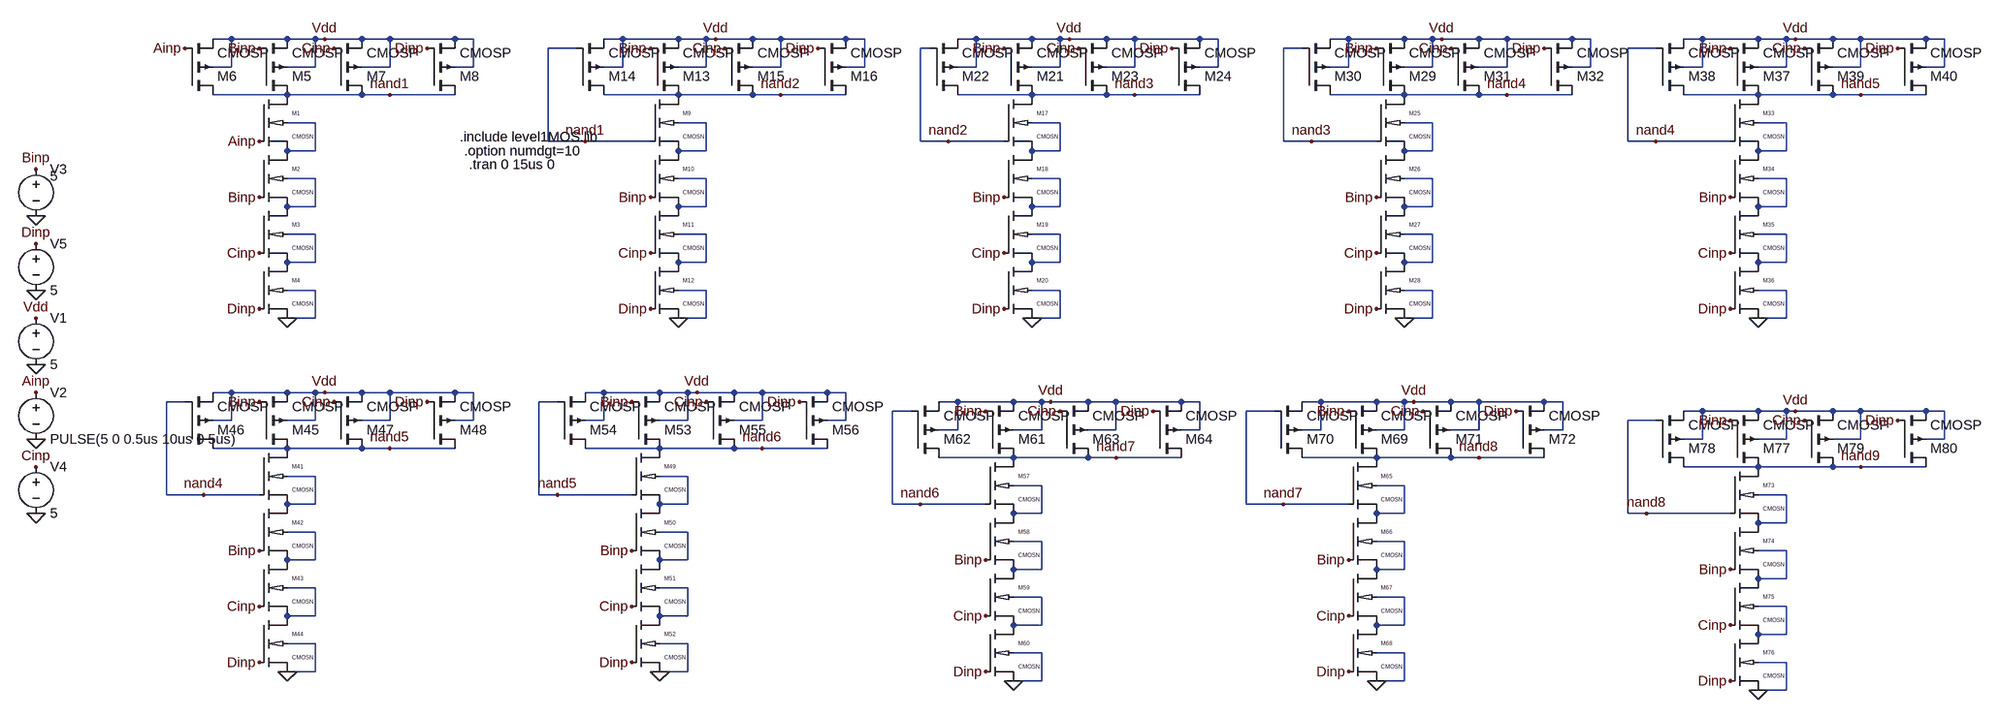
[diagram p0: schematic 4inpNANDcasc5.asc]
4inpNANDcasc5.asc, the LTspice schematic file:
Version 4
SHEET 1 1312 780
WIRE -2256 -1200 -2288 -1200
WIRE -2160 -1200 -2256 -1200
WIRE -2112 -1200 -2160 -1200
WIRE -2096 -1200 -2112 -1200
WIRE -2032 -1200 -2096 -1200
WIRE -1984 -1200 -2032 -1200
WIRE -1872 -1200 -1984 -1200
WIRE -1840 -1200 -1872 -1200
WIRE -1584 -1200 -1616 -1200
WIRE -1488 -1200 -1584 -1200
WIRE -1440 -1200 -1488 -1200
WIRE -1424 -1200 -1440 -1200
WIRE -1360 -1200 -1424 -1200
WIRE -1312 -1200 -1360 -1200
WIRE -1200 -1200 -1312 -1200
WIRE -1168 -1200 -1200 -1200
WIRE -976 -1200 -1008 -1200
WIRE -880 -1200 -976 -1200
WIRE -832 -1200 -880 -1200
WIRE -816 -1200 -832 -1200
WIRE -752 -1200 -816 -1200
WIRE -704 -1200 -752 -1200
WIRE -592 -1200 -704 -1200
WIRE -560 -1200 -592 -1200
WIRE -336 -1200 -368 -1200
WIRE -240 -1200 -336 -1200
WIRE -192 -1200 -240 -1200
WIRE -176 -1200 -192 -1200
WIRE -112 -1200 -176 -1200
WIRE -64 -1200 -112 -1200
WIRE 48 -1200 -64 -1200
WIRE 80 -1200 48 -1200
WIRE 272 -1200 240 -1200
WIRE 368 -1200 272 -1200
WIRE 416 -1200 368 -1200
WIRE 432 -1200 416 -1200
WIRE 496 -1200 432 -1200
WIRE 544 -1200 496 -1200
WIRE 656 -1200 544 -1200
WIRE 688 -1200 656 -1200
WIRE -1664 -1184 -1712 -1184
WIRE -1056 -1184 -1072 -1184
WIRE -416 -1184 -448 -1184
WIRE 192 -1184 144 -1184
WIRE -2256 -1152 -2256 -1200
WIRE -2256 -1152 -2288 -1152
WIRE -2112 -1152 -2112 -1200
WIRE -2112 -1152 -2160 -1152
WIRE -1984 -1152 -1984 -1200
WIRE -1984 -1152 -2032 -1152
WIRE -1840 -1152 -1840 -1200
WIRE -1840 -1152 -1872 -1152
WIRE -1584 -1152 -1584 -1200
WIRE -1584 -1152 -1616 -1152
WIRE -1440 -1152 -1440 -1200
WIRE -1440 -1152 -1488 -1152
WIRE -1312 -1152 -1312 -1200
WIRE -1312 -1152 -1360 -1152
WIRE -1168 -1152 -1168 -1200
WIRE -1168 -1152 -1200 -1152
WIRE -976 -1152 -976 -1200
WIRE -976 -1152 -1008 -1152
WIRE -832 -1152 -832 -1200
WIRE -832 -1152 -880 -1152
WIRE -704 -1152 -704 -1200
WIRE -704 -1152 -752 -1152
WIRE -560 -1152 -560 -1200
WIRE -560 -1152 -592 -1152
WIRE -336 -1152 -336 -1200
WIRE -336 -1152 -368 -1152
WIRE -192 -1152 -192 -1200
WIRE -192 -1152 -240 -1152
WIRE -64 -1152 -64 -1200
WIRE -64 -1152 -112 -1152
WIRE 80 -1152 80 -1200
WIRE 80 -1152 48 -1152
WIRE 272 -1152 272 -1200
WIRE 272 -1152 240 -1152
WIRE 416 -1152 416 -1200
WIRE 416 -1152 368 -1152
WIRE 544 -1152 544 -1200
WIRE 544 -1152 496 -1152
WIRE 688 -1152 688 -1200
WIRE 688 -1152 656 -1152
WIRE -2160 -1104 -2288 -1104
WIRE -2032 -1104 -2160 -1104
WIRE -1984 -1104 -2032 -1104
WIRE -1872 -1104 -1984 -1104
WIRE -1488 -1104 -1616 -1104
WIRE -1360 -1104 -1488 -1104
WIRE -1312 -1104 -1360 -1104
WIRE -1200 -1104 -1312 -1104
WIRE -880 -1104 -1008 -1104
WIRE -752 -1104 -880 -1104
WIRE -704 -1104 -752 -1104
WIRE -592 -1104 -704 -1104
WIRE -240 -1104 -368 -1104
WIRE -112 -1104 -240 -1104
WIRE -64 -1104 -112 -1104
WIRE 48 -1104 -64 -1104
WIRE 368 -1104 240 -1104
WIRE 496 -1104 368 -1104
WIRE 544 -1104 496 -1104
WIRE 656 -1104 544 -1104
WIRE -2112 -1056 -2160 -1056
WIRE -1440 -1056 -1488 -1056
WIRE -832 -1056 -880 -1056
WIRE -192 -1056 -240 -1056
WIRE 416 -1056 368 -1056
WIRE -1712 -1024 -1712 -1184
WIRE -1648 -1024 -1712 -1024
WIRE -1536 -1024 -1648 -1024
WIRE -1072 -1024 -1072 -1184
WIRE -1024 -1024 -1072 -1024
WIRE -928 -1024 -1024 -1024
WIRE -448 -1024 -448 -1184
WIRE -400 -1024 -448 -1024
WIRE -288 -1024 -400 -1024
WIRE 144 -1024 144 -1184
WIRE 192 -1024 144 -1024
WIRE 320 -1024 192 -1024
WIRE -2112 -1008 -2112 -1056
WIRE -2112 -1008 -2160 -1008
WIRE -1440 -1008 -1440 -1056
WIRE -1440 -1008 -1488 -1008
WIRE -832 -1008 -832 -1056
WIRE -832 -1008 -880 -1008
WIRE -192 -1008 -192 -1056
WIRE -192 -1008 -240 -1008
WIRE 416 -1008 416 -1056
WIRE 416 -1008 368 -1008
WIRE -2112 -960 -2160 -960
WIRE -1440 -960 -1488 -960
WIRE -832 -960 -880 -960
WIRE -192 -960 -240 -960
WIRE 416 -960 368 -960
WIRE -2112 -912 -2112 -960
WIRE -2112 -912 -2160 -912
WIRE -1440 -912 -1440 -960
WIRE -1440 -912 -1488 -912
WIRE -832 -912 -832 -960
WIRE -832 -912 -880 -912
WIRE -192 -912 -192 -960
WIRE -192 -912 -240 -912
WIRE 416 -912 416 -960
WIRE 416 -912 368 -912
WIRE -2112 -864 -2160 -864
WIRE -1440 -864 -1488 -864
WIRE -832 -864 -880 -864
WIRE -192 -864 -240 -864
WIRE 416 -864 368 -864
WIRE -2112 -816 -2112 -864
WIRE -2112 -816 -2160 -816
WIRE -1440 -816 -1440 -864
WIRE -1440 -816 -1488 -816
WIRE -832 -816 -832 -864
WIRE -832 -816 -880 -816
WIRE -192 -816 -192 -864
WIRE -192 -816 -240 -816
WIRE 416 -816 416 -864
WIRE 416 -816 368 -816
WIRE -2112 -768 -2160 -768
WIRE -1440 -768 -1488 -768
WIRE -832 -768 -880 -768
WIRE -192 -768 -240 -768
WIRE 416 -768 368 -768
WIRE -2112 -720 -2112 -768
WIRE -2112 -720 -2160 -720
WIRE -1440 -720 -1440 -768
WIRE -1440 -720 -1488 -720
WIRE -832 -720 -832 -768
WIRE -832 -720 -880 -720
WIRE -192 -720 -192 -768
WIRE -192 -720 -240 -720
WIRE 416 -720 416 -768
WIRE 416 -720 368 -720
WIRE -2256 -592 -2288 -592
WIRE -2160 -592 -2256 -592
WIRE -2112 -592 -2160 -592
WIRE -2096 -592 -2112 -592
WIRE -2032 -592 -2096 -592
WIRE -1984 -592 -2032 -592
WIRE -1872 -592 -1984 -592
WIRE -1840 -592 -1872 -592
WIRE -1616 -592 -1648 -592
WIRE -1520 -592 -1616 -592
WIRE -1472 -592 -1520 -592
WIRE -1456 -592 -1472 -592
WIRE -1392 -592 -1456 -592
WIRE -1344 -592 -1392 -592
WIRE -1232 -592 -1344 -592
WIRE -1200 -592 -1232 -592
WIRE -2336 -576 -2368 -576
WIRE -1696 -576 -1728 -576
WIRE -1008 -576 -1040 -576
WIRE -912 -576 -1008 -576
WIRE -864 -576 -912 -576
WIRE -848 -576 -864 -576
WIRE -784 -576 -848 -576
WIRE -736 -576 -784 -576
WIRE -624 -576 -736 -576
WIRE -592 -576 -624 -576
WIRE -384 -576 -416 -576
WIRE -288 -576 -384 -576
WIRE -240 -576 -288 -576
WIRE -224 -576 -240 -576
WIRE -160 -576 -224 -576
WIRE -112 -576 -160 -576
WIRE 0 -576 -112 -576
WIRE 32 -576 0 -576
WIRE -1088 -560 -1120 -560
WIRE -464 -560 -512 -560
WIRE 272 -560 240 -560
WIRE 368 -560 272 -560
WIRE 416 -560 368 -560
WIRE 432 -560 416 -560
WIRE 496 -560 432 -560
WIRE 544 -560 496 -560
WIRE 656 -560 544 -560
WIRE 688 -560 656 -560
WIRE -2256 -544 -2256 -592
WIRE -2256 -544 -2288 -544
WIRE -2112 -544 -2112 -592
WIRE -2112 -544 -2160 -544
WIRE -1984 -544 -1984 -592
WIRE -1984 -544 -2032 -544
WIRE -1840 -544 -1840 -592
WIRE -1840 -544 -1872 -544
WIRE -1616 -544 -1616 -592
WIRE -1616 -544 -1648 -544
WIRE -1472 -544 -1472 -592
WIRE -1472 -544 -1520 -544
WIRE -1344 -544 -1344 -592
WIRE -1344 -544 -1392 -544
WIRE -1200 -544 -1200 -592
WIRE -1200 -544 -1232 -544
WIRE 192 -544 144 -544
WIRE -1008 -528 -1008 -576
WIRE -1008 -528 -1040 -528
WIRE -864 -528 -864 -576
WIRE -864 -528 -912 -528
WIRE -736 -528 -736 -576
WIRE -736 -528 -784 -528
WIRE -592 -528 -592 -576
WIRE -592 -528 -624 -528
WIRE -384 -528 -384 -576
WIRE -384 -528 -416 -528
WIRE -240 -528 -240 -576
WIRE -240 -528 -288 -528
WIRE -112 -528 -112 -576
WIRE -112 -528 -160 -528
WIRE 32 -528 32 -576
WIRE 32 -528 0 -528
WIRE 272 -512 272 -560
WIRE 272 -512 240 -512
WIRE 416 -512 416 -560
WIRE 416 -512 368 -512
WIRE 544 -512 544 -560
WIRE 544 -512 496 -512
WIRE 688 -512 688 -560
WIRE 688 -512 656 -512
WIRE -2160 -496 -2288 -496
WIRE -2032 -496 -2160 -496
WIRE -1984 -496 -2032 -496
WIRE -1872 -496 -1984 -496
WIRE -1520 -496 -1648 -496
WIRE -1392 -496 -1520 -496
WIRE -1344 -496 -1392 -496
WIRE -1232 -496 -1344 -496
WIRE -912 -480 -1040 -480
WIRE -784 -480 -912 -480
WIRE -736 -480 -784 -480
WIRE -624 -480 -736 -480
WIRE -288 -480 -416 -480
WIRE -160 -480 -288 -480
WIRE -112 -480 -160 -480
WIRE 0 -480 -112 -480
WIRE 368 -464 240 -464
WIRE 496 -464 368 -464
WIRE 544 -464 496 -464
WIRE 656 -464 544 -464
WIRE -2112 -448 -2160 -448
WIRE -1472 -448 -1520 -448
WIRE -864 -432 -912 -432
WIRE -240 -432 -288 -432
WIRE -2368 -416 -2368 -576
WIRE -2304 -416 -2368 -416
WIRE -2208 -416 -2304 -416
WIRE -1728 -416 -1728 -576
WIRE -1696 -416 -1728 -416
WIRE -1568 -416 -1696 -416
WIRE 416 -416 368 -416
WIRE -2112 -400 -2112 -448
WIRE -2112 -400 -2160 -400
WIRE -1472 -400 -1472 -448
WIRE -1472 -400 -1520 -400
WIRE -1120 -400 -1120 -560
WIRE -1072 -400 -1120 -400
WIRE -960 -400 -1072 -400
WIRE -512 -400 -512 -560
WIRE -448 -400 -512 -400
WIRE -336 -400 -448 -400
WIRE -864 -384 -864 -432
WIRE -864 -384 -912 -384
WIRE -240 -384 -240 -432
WIRE -240 -384 -288 -384
WIRE 144 -384 144 -544
WIRE 176 -384 144 -384
WIRE 320 -384 176 -384
WIRE 416 -368 416 -416
WIRE 416 -368 368 -368
WIRE -2112 -352 -2160 -352
WIRE -1472 -352 -1520 -352
WIRE -864 -336 -912 -336
WIRE -240 -336 -288 -336
WIRE 416 -320 368 -320
WIRE -2112 -304 -2112 -352
WIRE -2112 -304 -2160 -304
WIRE -1472 -304 -1472 -352
WIRE -1472 -304 -1520 -304
WIRE -864 -288 -864 -336
WIRE -864 -288 -912 -288
WIRE -240 -288 -240 -336
WIRE -240 -288 -288 -288
WIRE 416 -272 416 -320
WIRE 416 -272 368 -272
WIRE -2112 -256 -2160 -256
WIRE -1472 -256 -1520 -256
WIRE -864 -240 -912 -240
WIRE -240 -240 -288 -240
WIRE 416 -224 368 -224
WIRE -2112 -208 -2112 -256
WIRE -2112 -208 -2160 -208
WIRE -1472 -208 -1472 -256
WIRE -1472 -208 -1520 -208
WIRE -864 -192 -864 -240
WIRE -864 -192 -912 -192
WIRE -240 -192 -240 -240
WIRE -240 -192 -288 -192
WIRE 416 -176 416 -224
WIRE 416 -176 368 -176
WIRE -2112 -160 -2160 -160
WIRE -1472 -160 -1520 -160
WIRE -864 -144 -912 -144
WIRE -240 -144 -288 -144
WIRE 416 -128 368 -128
WIRE -2112 -112 -2112 -160
WIRE -2112 -112 -2160 -112
WIRE -1472 -112 -1472 -160
WIRE -1472 -112 -1520 -112
WIRE -864 -96 -864 -144
WIRE -864 -96 -912 -96
WIRE -240 -96 -240 -144
WIRE -240 -96 -288 -96
WIRE 416 -80 416 -128
WIRE 416 -80 368 -80
FLAG -2208 -928 Binp
FLAG -2208 -1184 Binp
FLAG -2208 -832 Cinp
FLAG -2080 -1184 Cinp
FLAG -2208 -736 Dinp
FLAG -1920 -1184 Dinp
FLAG -2160 -720 0
FLAG -2592 -512 0
FLAG -2592 -640 0
FLAG -2592 -592 Ainp
FLAG -2592 -720 Vdd
FLAG -2096 -1200 Vdd
FLAG -2592 -896 0
FLAG -2592 -384 0
FLAG -2592 -768 0
FLAG -2592 -976 Binp
FLAG -2592 -464 Cinp
FLAG -2592 -848 Dinp
FLAG -2208 -1024 Ainp
FLAG -2336 -1184 Ainp
FLAG -1984 -1104 nand1
FLAG -1536 -928 Binp
FLAG -1536 -1184 Binp
FLAG -1536 -832 Cinp
FLAG -1408 -1184 Cinp
FLAG -1536 -736 Dinp
FLAG -1248 -1184 Dinp
FLAG -1488 -720 0
FLAG -1424 -1200 Vdd
FLAG -1312 -1104 nand2
FLAG -928 -928 Binp
FLAG -928 -1184 Binp
FLAG -928 -832 Cinp
FLAG -800 -1184 Cinp
FLAG -928 -736 Dinp
FLAG -640 -1184 Dinp
FLAG -880 -720 0
FLAG -816 -1200 Vdd
FLAG -704 -1104 nand3
FLAG -288 -928 Binp
FLAG -288 -1184 Binp
FLAG -288 -832 Cinp
FLAG -160 -1184 Cinp
FLAG -288 -736 Dinp
FLAG 0 -1184 Dinp
FLAG -240 -720 0
FLAG -176 -1200 Vdd
FLAG -64 -1104 nand4
FLAG 320 -928 Binp
FLAG 320 -1184 Binp
FLAG 320 -832 Cinp
FLAG 448 -1184 Cinp
FLAG 320 -736 Dinp
FLAG 608 -1184 Dinp
FLAG 368 -720 0
FLAG 432 -1200 Vdd
FLAG 544 -1104 nand5
FLAG -2208 -320 Binp
FLAG -2208 -576 Binp
FLAG -2208 -224 Cinp
FLAG -2080 -576 Cinp
FLAG -2208 -128 Dinp
FLAG -1920 -576 Dinp
FLAG -2160 -112 0
FLAG -2096 -592 Vdd
FLAG -1984 -496 nand5
FLAG -1568 -320 Binp
FLAG -1568 -576 Binp
FLAG -1568 -224 Cinp
FLAG -1440 -576 Cinp
FLAG -1568 -128 Dinp
FLAG -1280 -576 Dinp
FLAG -1520 -112 0
FLAG -1456 -592 Vdd
FLAG -1344 -496 nand6
FLAG -960 -304 Binp
FLAG -960 -560 Binp
FLAG -960 -208 Cinp
FLAG -832 -560 Cinp
FLAG -960 -112 Dinp
FLAG -672 -560 Dinp
FLAG -912 -96 0
FLAG -848 -576 Vdd
FLAG -736 -480 nand7
FLAG -336 -304 Binp
FLAG -336 -560 Binp
FLAG -336 -208 Cinp
FLAG -208 -560 Cinp
FLAG -336 -112 Dinp
FLAG -48 -560 Dinp
FLAG -288 -96 0
FLAG -224 -576 Vdd
FLAG -112 -480 nand8
FLAG 320 -288 Binp
FLAG 320 -544 Binp
FLAG 320 -192 Cinp
FLAG 448 -544 Cinp
FLAG 320 -96 Dinp
FLAG 608 -544 Dinp
FLAG 368 -80 0
FLAG 432 -560 Vdd
FLAG 544 -464 nand9
FLAG -1648 -1024 nand1
FLAG -1024 -1024 nand2
FLAG -400 -1024 nand3
FLAG 192 -1024 nand4
FLAG -2304 -416 nand4
FLAG -1696 -416 nand5
FLAG -1072 -400 nand6
FLAG -448 -400 nand7
FLAG 176 -384 nand8
SYMBOL cmosn -2208 -1104 R0
SYMATTR InstName M1
SYMATTR Value2 l=0.36u w=0.72u
SYMBOL cmosn -2208 -1008 R0
SYMATTR InstName M2
SYMATTR Value2 l=0.36u w=0.72u
SYMBOL cmosn -2208 -912 R0
SYMATTR InstName M3
SYMATTR Value2 l=0.36u w=0.72u
SYMBOL cmosn -2208 -816 R0
SYMATTR InstName M4
SYMATTR Value2 l=0.36u w=0.72u
SYMBOL cmosp -2208 -1104 M180
SYMATTR InstName M5
SYMATTR Value2 l=0.36u w=2.88u
SYMBOL cmosp -2336 -1104 M180
SYMATTR InstName M6
SYMATTR Value2 l=0.36u w=2.88u
SYMBOL cmosp -2080 -1104 M180
SYMATTR InstName M7
SYMATTR Value2 l=0.36u w=2.88u
SYMBOL cmosp -1920 -1104 M180
SYMATTR InstName M8
SYMATTR Value2 l=0.36u w=2.88u
SYMBOL voltage -2592 -736 R0
WINDOW 123 0 0 Left 2
WINDOW 39 0 0 Left 2
SYMATTR InstName V1
SYMATTR Value 5
SYMBOL voltage -2592 -608 R0
WINDOW 123 0 0 Left 2
WINDOW 39 0 0 Left 2
SYMATTR InstName V2
SYMATTR Value PULSE(5 0 0.5us 10us 0 5us)
SYMBOL voltage -2592 -992 R0
WINDOW 123 0 0 Left 2
WINDOW 39 0 0 Left 2
WINDOW 3 24 28 Left 2
SYMATTR InstName V3
SYMATTR Value 5
SYMBOL voltage -2592 -480 R0
WINDOW 123 0 0 Left 2
WINDOW 39 0 0 Left 2
SYMATTR InstName V4
SYMATTR Value 5
SYMBOL voltage -2592 -864 R0
WINDOW 123 0 0 Left 2
WINDOW 39 0 0 Left 2
SYMATTR InstName V5
SYMATTR Value 5
SYMBOL cmosn -1536 -1104 R0
SYMATTR InstName M9
SYMATTR Value2 l=0.36u w=0.72u
SYMBOL cmosn -1536 -1008 R0
SYMATTR InstName M10
SYMATTR Value2 l=0.36u w=0.72u
SYMBOL cmosn -1536 -912 R0
SYMATTR InstName M11
SYMATTR Value2 l=0.36u w=0.72u
SYMBOL cmosn -1536 -816 R0
SYMATTR InstName M12
SYMATTR Value2 l=0.36u w=0.72u
SYMBOL cmosp -1536 -1104 M180
SYMATTR InstName M13
SYMATTR Value2 l=0.36u w=2.88u
SYMBOL cmosp -1664 -1104 M180
SYMATTR InstName M14
SYMATTR Value2 l=0.36u w=2.88u
SYMBOL cmosp -1408 -1104 M180
SYMATTR InstName M15
SYMATTR Value2 l=0.36u w=2.88u
SYMBOL cmosp -1248 -1104 M180
SYMATTR InstName M16
SYMATTR Value2 l=0.36u w=2.88u
SYMBOL cmosn -928 -1104 R0
SYMATTR InstName M17
SYMATTR Value2 l=0.36u w=0.72u
SYMBOL cmosn -928 -1008 R0
SYMATTR InstName M18
SYMATTR Value2 l=0.36u w=0.72u
SYMBOL cmosn -928 -912 R0
SYMATTR InstName M19
SYMATTR Value2 l=0.36u w=0.72u
SYMBOL cmosn -928 -816 R0
SYMATTR InstName M20
SYMATTR Value2 l=0.36u w=0.72u
SYMBOL cmosp -928 -1104 M180
SYMATTR InstName M21
SYMATTR Value2 l=0.36u w=2.88u
SYMBOL cmosp -1056 -1104 M180
SYMATTR InstName M22
SYMATTR Value2 l=0.36u w=2.88u
SYMBOL cmosp -800 -1104 M180
SYMATTR InstName M23
SYMATTR Value2 l=0.36u w=2.88u
SYMBOL cmosp -640 -1104 M180
SYMATTR InstName M24
SYMATTR Value2 l=0.36u w=2.88u
SYMBOL cmosn -288 -1104 R0
SYMATTR InstName M25
SYMATTR Value2 l=0.36u w=0.72u
SYMBOL cmosn -288 -1008 R0
SYMATTR InstName M26
SYMATTR Value2 l=0.36u w=0.72u
SYMBOL cmosn -288 -912 R0
SYMATTR InstName M27
SYMATTR Value2 l=0.36u w=0.72u
SYMBOL cmosn -288 -816 R0
SYMATTR InstName M28
SYMATTR Value2 l=0.36u w=0.72u
SYMBOL cmosp -288 -1104 M180
SYMATTR InstName M29
SYMATTR Value2 l=0.36u w=2.88u
SYMBOL cmosp -416 -1104 M180
SYMATTR InstName M30
SYMATTR Value2 l=0.36u w=2.88u
SYMBOL cmosp -160 -1104 M180
SYMATTR InstName M31
SYMATTR Value2 l=0.36u w=2.88u
SYMBOL cmosp 0 -1104 M180
SYMATTR InstName M32
SYMATTR Value2 l=0.36u w=2.88u
SYMBOL cmosn 320 -1104 R0
SYMATTR InstName M33
SYMATTR Value2 l=0.36u w=0.72u
SYMBOL cmosn 320 -1008 R0
SYMATTR InstName M34
SYMATTR Value2 l=0.36u w=0.72u
SYMBOL cmosn 320 -912 R0
SYMATTR InstName M35
SYMATTR Value2 l=0.36u w=0.72u
SYMBOL cmosn 320 -816 R0
SYMATTR InstName M36
SYMATTR Value2 l=0.36u w=0.72u
SYMBOL cmosp 320 -1104 M180
SYMATTR InstName M37
SYMATTR Value2 l=0.36u w=2.88u
SYMBOL cmosp 192 -1104 M180
SYMATTR InstName M38
SYMATTR Value2 l=0.36u w=2.88u
SYMBOL cmosp 448 -1104 M180
SYMATTR InstName M39
SYMATTR Value2 l=0.36u w=2.88u
SYMBOL cmosp 608 -1104 M180
SYMATTR InstName M40
SYMATTR Value2 l=0.36u w=2.88u
SYMBOL cmosn -2208 -496 R0
SYMATTR InstName M41
SYMATTR Value2 l=0.36u w=0.72u
SYMBOL cmosn -2208 -400 R0
SYMATTR InstName M42
SYMATTR Value2 l=0.36u w=0.72u
SYMBOL cmosn -2208 -304 R0
SYMATTR InstName M43
SYMATTR Value2 l=0.36u w=0.72u
SYMBOL cmosn -2208 -208 R0
SYMATTR InstName M44
SYMATTR Value2 l=0.36u w=0.72u
SYMBOL cmosp -2208 -496 M180
SYMATTR InstName M45
SYMATTR Value2 l=0.36u w=2.88u
SYMBOL cmosp -2336 -496 M180
SYMATTR InstName M46
SYMATTR Value2 l=0.36u w=2.88u
SYMBOL cmosp -2080 -496 M180
SYMATTR InstName M47
SYMATTR Value2 l=0.36u w=2.88u
SYMBOL cmosp -1920 -496 M180
SYMATTR InstName M48
SYMATTR Value2 l=0.36u w=2.88u
SYMBOL cmosn -1568 -496 R0
SYMATTR InstName M49
SYMATTR Value2 l=0.36u w=0.72u
SYMBOL cmosn -1568 -400 R0
SYMATTR InstName M50
SYMATTR Value2 l=0.36u w=0.72u
SYMBOL cmosn -1568 -304 R0
SYMATTR InstName M51
SYMATTR Value2 l=0.36u w=0.72u
SYMBOL cmosn -1568 -208 R0
SYMATTR InstName M52
SYMATTR Value2 l=0.36u w=0.72u
SYMBOL cmosp -1568 -496 M180
SYMATTR InstName M53
SYMATTR Value2 l=0.36u w=2.88u
SYMBOL cmosp -1696 -496 M180
SYMATTR InstName M54
SYMATTR Value2 l=0.36u w=2.88u
SYMBOL cmosp -1440 -496 M180
SYMATTR InstName M55
SYMATTR Value2 l=0.36u w=2.88u
SYMBOL cmosp -1280 -496 M180
SYMATTR InstName M56
SYMATTR Value2 l=0.36u w=2.88u
SYMBOL cmosn -960 -480 R0
SYMATTR InstName M57
SYMATTR Value2 l=0.36u w=0.72u
SYMBOL cmosn -960 -384 R0
SYMATTR InstName M58
SYMATTR Value2 l=0.36u w=0.72u
SYMBOL cmosn -960 -288 R0
SYMATTR InstName M59
SYMATTR Value2 l=0.36u w=0.72u
SYMBOL cmosn -960 -192 R0
SYMATTR InstName M60
SYMATTR Value2 l=0.36u w=0.72u
SYMBOL cmosp -960 -480 M180
SYMATTR InstName M61
SYMATTR Value2 l=0.36u w=2.88u
SYMBOL cmosp -1088 -480 M180
SYMATTR InstName M62
SYMATTR Value2 l=0.36u w=2.88u
SYMBOL cmosp -832 -480 M180
SYMATTR InstName M63
SYMATTR Value2 l=0.36u w=2.88u
SYMBOL cmosp -672 -480 M180
SYMATTR InstName M64
SYMATTR Value2 l=0.36u w=2.88u
SYMBOL cmosn -336 -480 R0
SYMATTR InstName M65
SYMATTR Value2 l=0.36u w=0.72u
SYMBOL cmosn -336 -384 R0
SYMATTR InstName M66
SYMATTR Value2 l=0.36u w=0.72u
SYMBOL cmosn -336 -288 R0
SYMATTR InstName M67
SYMATTR Value2 l=0.36u w=0.72u
SYMBOL cmosn -336 -192 R0
SYMATTR InstName M68
SYMATTR Value2 l=0.36u w=0.72u
SYMBOL cmosp -336 -480 M180
SYMATTR InstName M69
SYMATTR Value2 l=0.36u w=2.88u
SYMBOL cmosp -464 -480 M180
SYMATTR InstName M70
SYMATTR Value2 l=0.36u w=2.88u
SYMBOL cmosp -208 -480 M180
SYMATTR InstName M71
SYMATTR Value2 l=0.36u w=2.88u
SYMBOL cmosp -48 -480 M180
SYMATTR InstName M72
SYMATTR Value2 l=0.36u w=2.88u
SYMBOL cmosn 320 -464 R0
SYMATTR InstName M73
SYMATTR Value2 l=0.36u w=0.72u
SYMBOL cmosn 320 -368 R0
SYMATTR InstName M74
SYMATTR Value2 l=0.36u w=0.72u
SYMBOL cmosn 320 -272 R0
SYMATTR InstName M75
SYMATTR Value2 l=0.36u w=0.72u
SYMBOL cmosn 320 -176 R0
SYMATTR InstName M76
SYMATTR Value2 l=0.36u w=0.72u
SYMBOL cmosp 320 -464 M180
SYMATTR InstName M77
SYMATTR Value2 l=0.36u w=2.88u
SYMBOL cmosp 192 -464 M180
SYMATTR InstName M78
SYMATTR Value2 l=0.36u w=2.88u
SYMBOL cmosp 448 -464 M180
SYMATTR InstName M79
SYMATTR Value2 l=0.36u w=2.88u
SYMBOL cmosp 608 -464 M180
SYMATTR InstName M80
SYMATTR Value2 l=0.36u w=2.88u
TEXT -1848 -984 Left 2 !.tran 0 15us 0
TEXT -1864 -1032 Left 2 !.include level1MOS.lib
TEXT -1856 -1008 Left 2 !.option numdgt=10

The netlist it stands for:
* 4inpNANDcasc5.asc
M1 nand1 Ainp N001 N001 CMOSN l=0.36u w=0.72u
M2 N001 Binp N006 N006 CMOSN l=0.36u w=0.72u
M3 N006 Cinp N011 N011 CMOSN l=0.36u w=0.72u
M4 N011 Dinp 0 0 CMOSN l=0.36u w=0.72u
M5 nand1 Binp Vdd Vdd CMOSP l=0.36u w=2.88u
M6 nand1 Ainp Vdd Vdd CMOSP l=0.36u w=2.88u
M7 nand1 Cinp Vdd Vdd CMOSP l=0.36u w=2.88u
M8 nand1 Dinp Vdd Vdd CMOSP l=0.36u w=2.88u
V1 Vdd 0 5
V2 Ainp 0 PULSE(5 0 0.5us 10us 0 5us)
V3 Binp 0 5
V4 Cinp 0 5
V5 Dinp 0 5
M9 nand2 nand1 N002 N002 CMOSN l=0.36u w=0.72u
M10 N002 Binp N007 N007 CMOSN l=0.36u w=0.72u
M11 N007 Cinp N012 N012 CMOSN l=0.36u w=0.72u
M12 N012 Dinp 0 0 CMOSN l=0.36u w=0.72u
M13 nand2 Binp Vdd Vdd CMOSP l=0.36u w=2.88u
M14 nand2 nand1 Vdd Vdd CMOSP l=0.36u w=2.88u
M15 nand2 Cinp Vdd Vdd CMOSP l=0.36u w=2.88u
M16 nand2 Dinp Vdd Vdd CMOSP l=0.36u w=2.88u
M17 nand3 nand2 N003 N003 CMOSN l=0.36u w=0.72u
M18 N003 Binp N008 N008 CMOSN l=0.36u w=0.72u
M19 N008 Cinp N013 N013 CMOSN l=0.36u w=0.72u
M20 N013 Dinp 0 0 CMOSN l=0.36u w=0.72u
M21 nand3 Binp Vdd Vdd CMOSP l=0.36u w=2.88u
M22 nand3 nand2 Vdd Vdd CMOSP l=0.36u w=2.88u
M23 nand3 Cinp Vdd Vdd CMOSP l=0.36u w=2.88u
M24 nand3 Dinp Vdd Vdd CMOSP l=0.36u w=2.88u
M25 nand4 nand3 N004 N004 CMOSN l=0.36u w=0.72u
M26 N004 Binp N009 N009 CMOSN l=0.36u w=0.72u
M27 N009 Cinp N014 N014 CMOSN l=0.36u w=0.72u
M28 N014 Dinp 0 0 CMOSN l=0.36u w=0.72u
M29 nand4 Binp Vdd Vdd CMOSP l=0.36u w=2.88u
M30 nand4 nand3 Vdd Vdd CMOSP l=0.36u w=2.88u
M31 nand4 Cinp Vdd Vdd CMOSP l=0.36u w=2.88u
M32 nand4 Dinp Vdd Vdd CMOSP l=0.36u w=2.88u
M33 nand5 nand4 N005 N005 CMOSN l=0.36u w=0.72u
M34 N005 Binp N010 N010 CMOSN l=0.36u w=0.72u
M35 N010 Cinp N015 N015 CMOSN l=0.36u w=0.72u
M36 N015 Dinp 0 0 CMOSN l=0.36u w=0.72u
M37 nand5 Binp Vdd Vdd CMOSP l=0.36u w=2.88u
M38 nand5 nand4 Vdd Vdd CMOSP l=0.36u w=2.88u
M39 nand5 Cinp Vdd Vdd CMOSP l=0.36u w=2.88u
M40 nand5 Dinp Vdd Vdd CMOSP l=0.36u w=2.88u
M41 nand5 nand4 N016 N016 CMOSN l=0.36u w=0.72u
M42 N016 Binp N021 N021 CMOSN l=0.36u w=0.72u
M43 N021 Cinp N026 N026 CMOSN l=0.36u w=0.72u
M44 N026 Dinp 0 0 CMOSN l=0.36u w=0.72u
M45 nand5 Binp Vdd Vdd CMOSP l=0.36u w=2.88u
M46 nand5 nand4 Vdd Vdd CMOSP l=0.36u w=2.88u
M47 nand5 Cinp Vdd Vdd CMOSP l=0.36u w=2.88u
M48 nand5 Dinp Vdd Vdd CMOSP l=0.36u w=2.88u
M49 nand6 nand5 N017 N017 CMOSN l=0.36u w=0.72u
M50 N017 Binp N022 N022 CMOSN l=0.36u w=0.72u
M51 N022 Cinp N027 N027 CMOSN l=0.36u w=0.72u
M52 N027 Dinp 0 0 CMOSN l=0.36u w=0.72u
M53 nand6 Binp Vdd Vdd CMOSP l=0.36u w=2.88u
M54 nand6 nand5 Vdd Vdd CMOSP l=0.36u w=2.88u
M55 nand6 Cinp Vdd Vdd CMOSP l=0.36u w=2.88u
M56 nand6 Dinp Vdd Vdd CMOSP l=0.36u w=2.88u
M57 nand7 nand6 N018 N018 CMOSN l=0.36u w=0.72u
M58 N018 Binp N023 N023 CMOSN l=0.36u w=0.72u
M59 N023 Cinp N028 N028 CMOSN l=0.36u w=0.72u
M60 N028 Dinp 0 0 CMOSN l=0.36u w=0.72u
M61 nand7 Binp Vdd Vdd CMOSP l=0.36u w=2.88u
M62 nand7 nand6 Vdd Vdd CMOSP l=0.36u w=2.88u
M63 nand7 Cinp Vdd Vdd CMOSP l=0.36u w=2.88u
M64 nand7 Dinp Vdd Vdd CMOSP l=0.36u w=2.88u
M65 nand8 nand7 N019 N019 CMOSN l=0.36u w=0.72u
M66 N019 Binp N024 N024 CMOSN l=0.36u w=0.72u
M67 N024 Cinp N029 N029 CMOSN l=0.36u w=0.72u
M68 N029 Dinp 0 0 CMOSN l=0.36u w=0.72u
M69 nand8 Binp Vdd Vdd CMOSP l=0.36u w=2.88u
M70 nand8 nand7 Vdd Vdd CMOSP l=0.36u w=2.88u
M71 nand8 Cinp Vdd Vdd CMOSP l=0.36u w=2.88u
M72 nand8 Dinp Vdd Vdd CMOSP l=0.36u w=2.88u
M73 nand9 nand8 N020 N020 CMOSN l=0.36u w=0.72u
M74 N020 Binp N025 N025 CMOSN l=0.36u w=0.72u
M75 N025 Cinp N030 N030 CMOSN l=0.36u w=0.72u
M76 N030 Dinp 0 0 CMOSN l=0.36u w=0.72u
M77 nand9 Binp Vdd Vdd CMOSP l=0.36u w=2.88u
M78 nand9 nand8 Vdd Vdd CMOSP l=0.36u w=2.88u
M79 nand9 Cinp Vdd Vdd CMOSP l=0.36u w=2.88u
M80 nand9 Dinp Vdd Vdd CMOSP l=0.36u w=2.88u
.model NMOS NMOS
.model PMOS PMOS
.lib standard.mos
.tran 0 15us 0
.include level1MOS.lib
.option numdgt=10
.lib tsmc018.lib
.backanno
.end